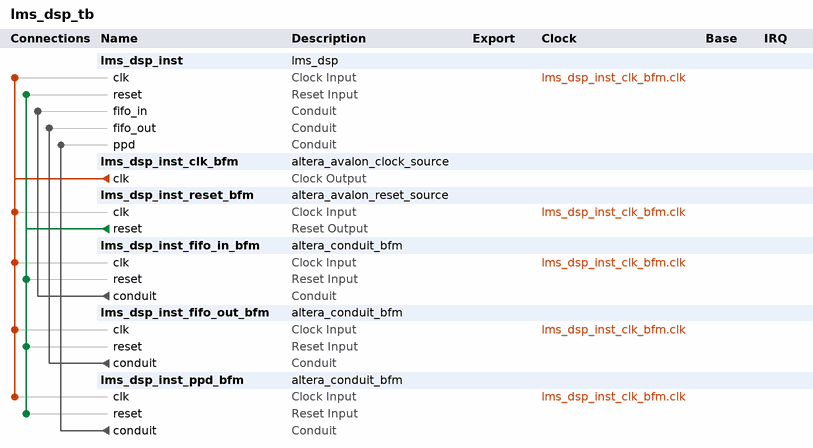
[diagram p0: system contents]
# Platform Designer (Qsys) system lms_dsp_tb, MAX 10 10M16SAU169C8G
# Parameters at their usual value, and those the tool derives, are not listed.
package require -exact qsys 18.1
create_system lms_dsp_tb
set_project_property DEVICE_FAMILY {MAX 10}
set_project_property DEVICE 10M16SAU169C8G

add_instance lms_dsp_inst lms_dsp 1.0

add_instance lms_dsp_inst_clk_bfm altera_avalon_clock_source 18.1
set_instance_parameter_value lms_dsp_inst_clk_bfm CLOCK_RATE 125000000

add_instance lms_dsp_inst_reset_bfm altera_avalon_reset_source 18.1
set_instance_parameter_value lms_dsp_inst_reset_bfm ASSERT_HIGH_RESET 0
set_instance_parameter_value lms_dsp_inst_reset_bfm INITIAL_RESET_CYCLES 50

add_instance lms_dsp_inst_fifo_in_bfm altera_conduit_bfm 18.1
set_instance_parameter_value lms_dsp_inst_fifo_in_bfm CLOCKED_SIGNAL true
set_instance_parameter_value lms_dsp_inst_fifo_in_bfm ENABLE_RESET true
set_instance_parameter_value lms_dsp_inst_fifo_in_bfm SIGNAL_DIRECTIONS output,output
set_instance_parameter_value lms_dsp_inst_fifo_in_bfm SIGNAL_ROLES wdata,wrreq
set_instance_parameter_value lms_dsp_inst_fifo_in_bfm SIGNAL_WIDTHS 48,1

add_instance lms_dsp_inst_fifo_out_bfm altera_conduit_bfm 18.1
set_instance_parameter_value lms_dsp_inst_fifo_out_bfm CLOCKED_SIGNAL true
set_instance_parameter_value lms_dsp_inst_fifo_out_bfm ENABLE_RESET true
set_instance_parameter_value lms_dsp_inst_fifo_out_bfm SIGNAL_DIRECTIONS input,input
set_instance_parameter_value lms_dsp_inst_fifo_out_bfm SIGNAL_ROLES wrdata,wrreq
set_instance_parameter_value lms_dsp_inst_fifo_out_bfm SIGNAL_WIDTHS 48,1

add_instance lms_dsp_inst_ppd_bfm altera_conduit_bfm 18.1
set_instance_parameter_value lms_dsp_inst_ppd_bfm CLOCKED_SIGNAL true
set_instance_parameter_value lms_dsp_inst_ppd_bfm ENABLE_RESET true
set_instance_parameter_value lms_dsp_inst_ppd_bfm SIGNAL_DIRECTIONS output,output,output,output,input,input,input
set_instance_parameter_value lms_dsp_inst_ppd_bfm SIGNAL_ROLES cfg_clear_rs,cfg_enable,cfg_passthrough_len,cfg_threshold,debug_count,debug_long_sum,debug_short_sum
set_instance_parameter_value lms_dsp_inst_ppd_bfm SIGNAL_WIDTHS 1,1,16,8,32,32,32

# connections
add_connection lms_dsp_inst_clk_bfm.clk lms_dsp_inst.clk clock
add_connection lms_dsp_inst_clk_bfm.clk lms_dsp_inst_fifo_in_bfm.clk clock
add_connection lms_dsp_inst_clk_bfm.clk lms_dsp_inst_fifo_out_bfm.clk clock
add_connection lms_dsp_inst_clk_bfm.clk lms_dsp_inst_ppd_bfm.clk clock
add_connection lms_dsp_inst_clk_bfm.clk lms_dsp_inst_reset_bfm.clk clock
add_connection lms_dsp_inst_reset_bfm.reset lms_dsp_inst.reset reset
add_connection lms_dsp_inst_reset_bfm.reset lms_dsp_inst_fifo_in_bfm.reset reset
add_connection lms_dsp_inst_reset_bfm.reset lms_dsp_inst_fifo_out_bfm.reset reset
add_connection lms_dsp_inst_reset_bfm.reset lms_dsp_inst_ppd_bfm.reset reset
add_connection lms_dsp_inst_fifo_in_bfm.conduit lms_dsp_inst.fifo_in conduit
add_connection lms_dsp_inst_fifo_out_bfm.conduit lms_dsp_inst.fifo_out conduit
add_connection lms_dsp_inst_ppd_bfm.conduit lms_dsp_inst.ppd conduit

set_interconnect_requirement {$system} qsys_mm.clockCrossingAdapter HANDSHAKE
set_interconnect_requirement {$system} qsys_mm.enableEccProtection FALSE
set_interconnect_requirement {$system} qsys_mm.insertDefaultSlave FALSE
set_interconnect_requirement {$system} qsys_mm.maxAdditionalLatency 1

save_system lms_dsp_tb.qsys
